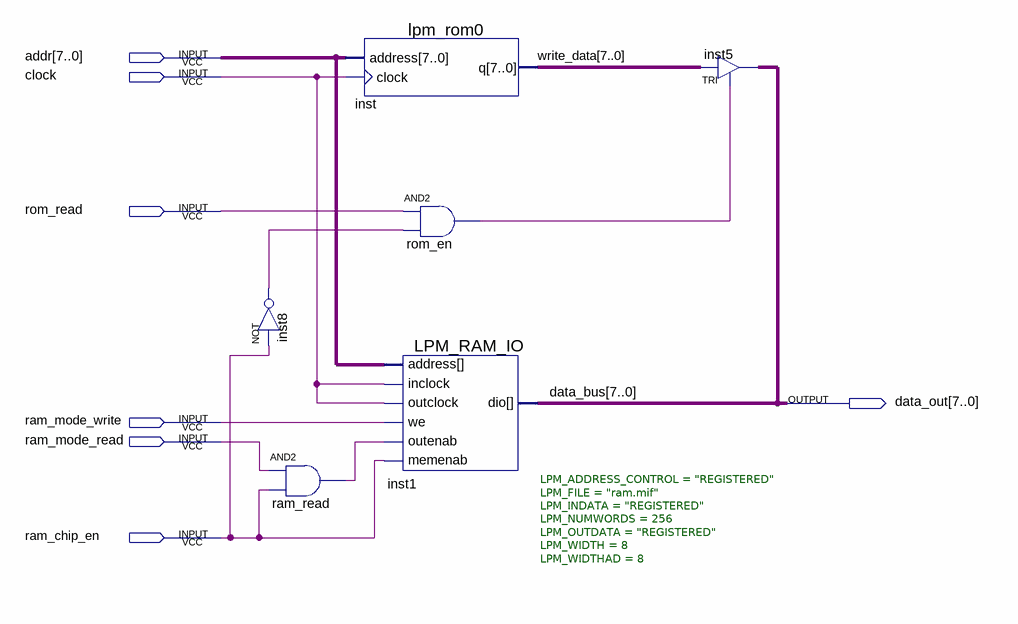
[diagram p0: schematic sheet]
// Quartus schematic lab3.bdf as structural Verilog: 6 symbols, 7 pins
module lab3 (
  input  [7:0] addr,
  input  clock,
  input  rom_read,
  input  ram_mode_write,
  input  ram_mode_read,
  input  ram_chip_en,
  output [7:0] data_out
);

  wire inst8_out, ram_read_out, rom_en_out;
  wire [7:0] write_data;

  not inst8 (inst8_out, ram_chip_en);
  and ram_read (ram_read_out, ram_mode_read, ram_chip_en);
  lpm_rom0 inst (.address(addr), .clock(clock), .q(write_data));
  and rom_en (rom_en_out, rom_read, inst8_out);
  LPM_RAM_IO #(.LPM_ADDRESS_CONTROL("REGISTERED"), .LPM_FILE("ram.mif"), .LPM_INDATA("REGISTERED"), .LPM_NUMWORDS(256), .LPM_OUTDATA("REGISTERED"), .LPM_WIDTH(8), .LPM_WIDTHAD(8)) inst1 (
    .address(addr), .outclock(clock), .memenab(ram_chip_en), .inclock(clock), .we(ram_mode_write),
    .outenab(ram_read_out), .dio(data_out));
  TRI inst5[7:0] (.IN(write_data), .OE(rom_en_out), .OUT(data_out));

  // Other names for the same wires on the sheet: data_bus[7:0] = data_out
endmodule
